# EAGLE design Temperature_sensor_Board2 (EAGLE 7.7.0)
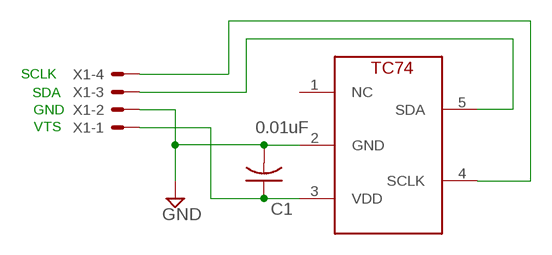
[diagram p0: schematic, sheet 1]

## Parts
C1  0.01uF  C-USC0805  [C0805]
S1  TC74  [SOT23-5L]
X1  22-23-2041  [22-23-2041]

## Nets
GND: C1.2 S1.2(GND) X1.2
N$2: C1.1 S1.3(VDD) X1.1
N$3: S1.5(SDA) X1.3
N$4: S1.4(SCLK) X1.4
Unconnected: S1.1(NC)

## Notes on the sheet
- SCLK
- SDA
- GND
- VTS

## Library data of the parts
C1 = rcl:C-US: CAPACITOR, American symbol
S1 = Mine:TC74
X1 = Mine:22-23-2041: .100" (2.54mm) Center Header - 4 Pin; MF: MOLEX; MPN: 22-23-2041; OC_FARNELL: 1462920; OC_NEWARK: 38C0355

## Board
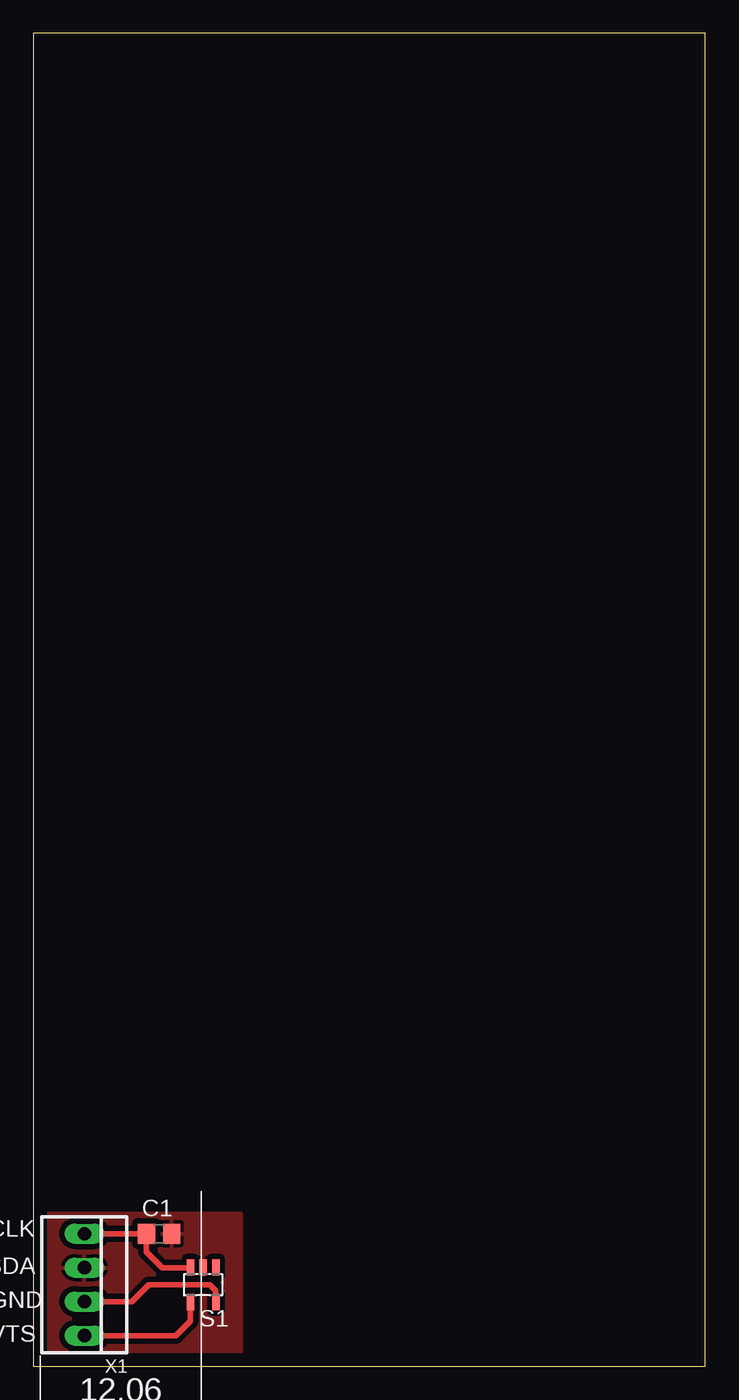
[diagram p1: board, top side]

Size 50.27 x 99.75 mm. Coordinates in mm from the lower left corner, seen from the top.
Outline: 0,0 50.27,0 50.27,99.75 0,99.75 0,0
Copper layers (1*16): Top 0.035mm / dielectric 1.5mm / Bottom 0.035mm
Design rules "default *": minimum track width 10mil, minimum drill 24mil, track to track 16mil, track to pad 14mil, pad to pad 14mil, via to via 14mil, smd to smd 14mil, copper to edge 40mil, drill to drill 8mil, minimum pad ring 10mil, minimum via ring 8mil, stop-mask expansion 4mil, vias tented up to drill 0mil, thermal gap 10mil

### Footprints (pad centres in the part's own frame; a part is rotated, then mirrored left to right if it is on the bottom)
C0805 = smd 1.3 x 1.5: 1 -0.95,0; 2 0.95,0
SOT23-5L = smd 0.55 x 1.2: 1 -0.95,-1.3; 2 0,-1.3; 3 0.95,-1.3; 4 0.95,1.3; 5 -0.95,1.3
22-23-2041 = drill 1 long: 1 -3.81,0; 2 -1.27,0; 3 1.27,0; 4 3.81,0

### Placement (x,y rotation side)
C1  9.4,9.91 0 top
S1  12.7,6.1 180 top
X1  3.81,6.1 270 top

### Tracks (layer width: path | path; a pad name or v marks a point on that pad's centre or on a via)
GND
  pour Top: 0.51,11.43 15.49,11.43 15.49,0.76 0.51,0.76
N$2
  Top 0.406: S1.3 11.72,7.37 9.65,7.37 8.45,8.57 C1.1 X1.1
N$3
  Top 0.406: S1.5 13.65,5.65 13.21,6.1 8.64,6.1 7.37,4.83 X1.3
N$4
  Top 0.406: X1.4 10.67,2.29 11.75,3.37 S1.4

### Text on the board
tPlace: SCLK | SDA | GND | VTS